# EAGLE schematic hx1 (EAGLE 7.2.0)
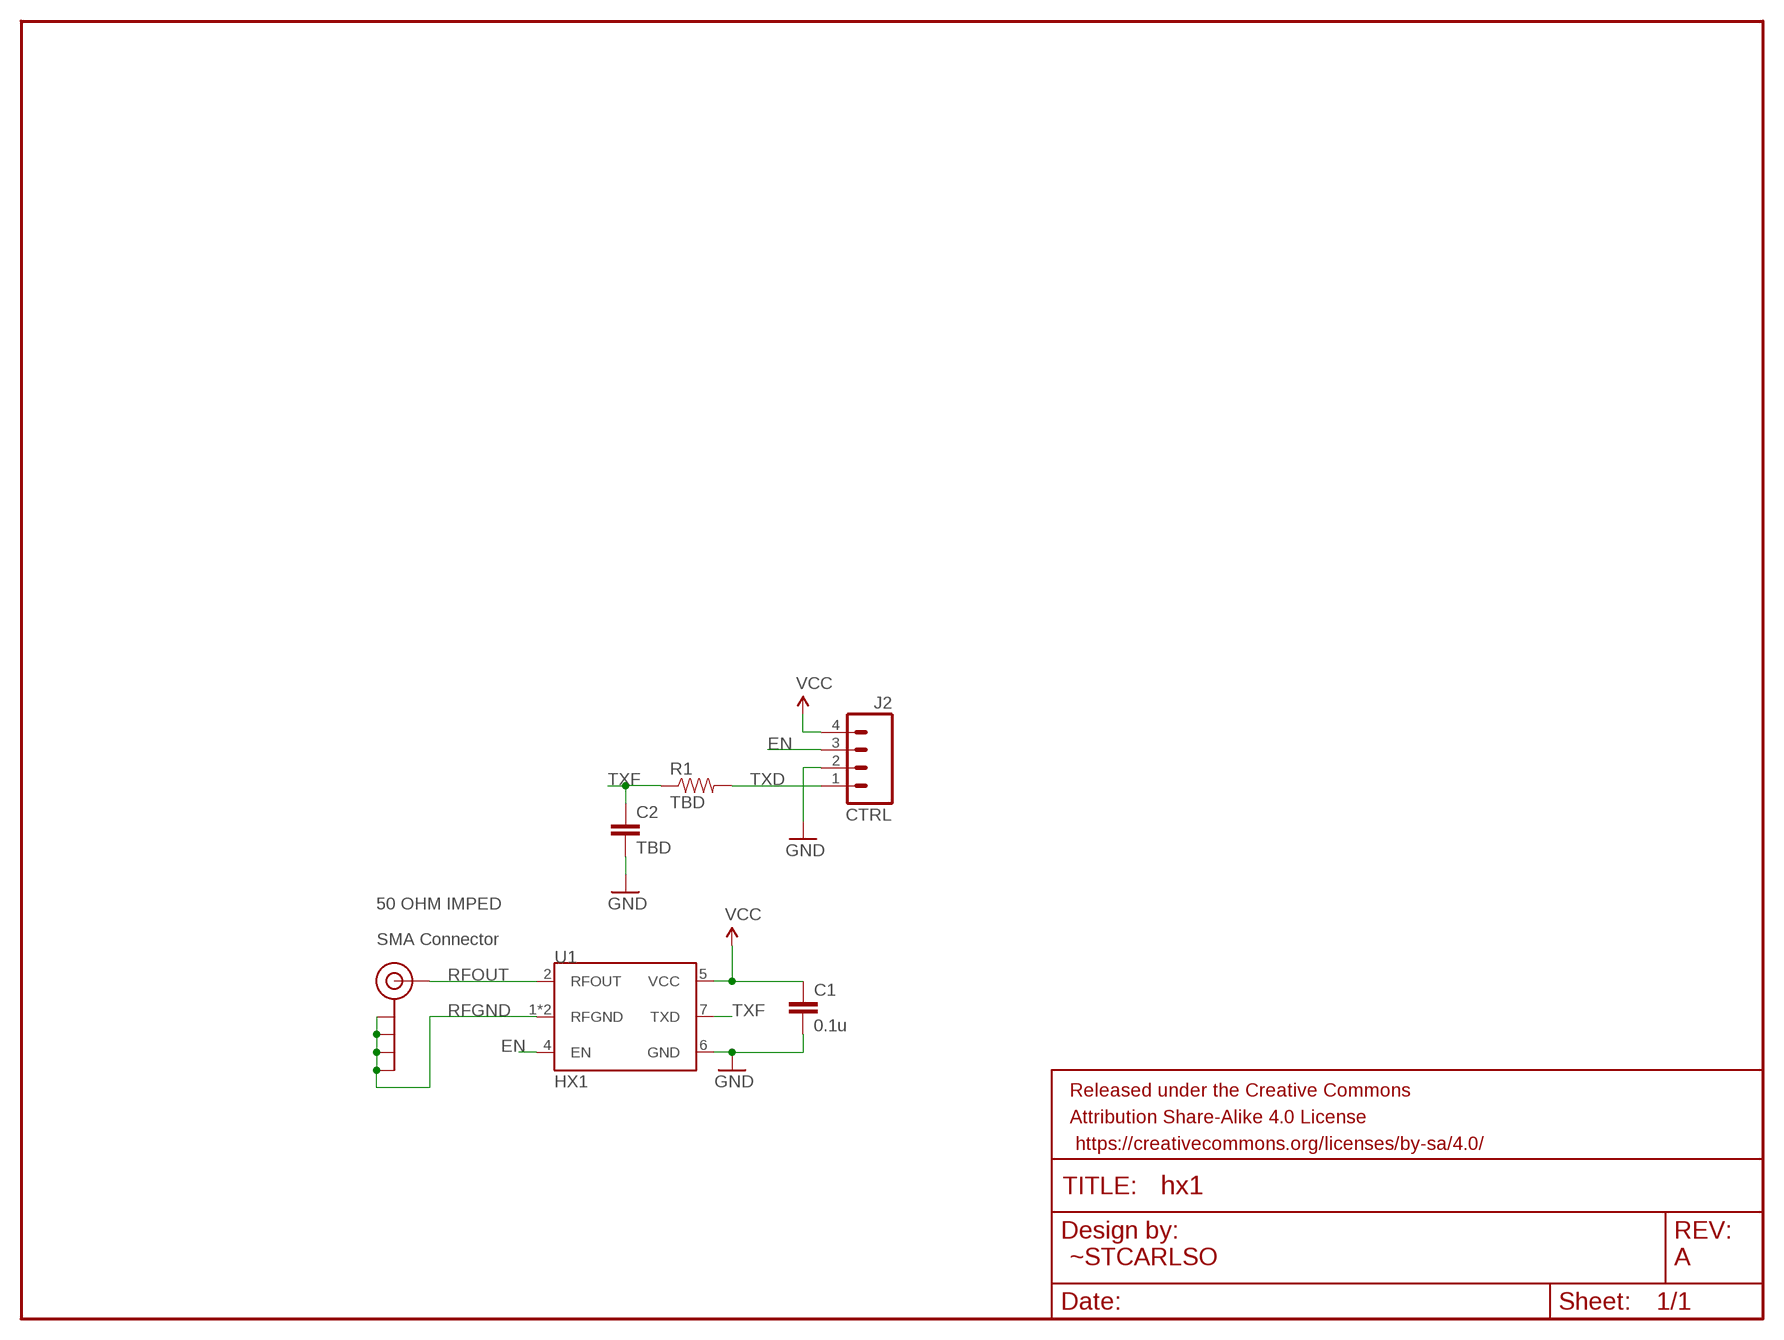
[diagram p0: schematic, sheet 1]

## Parts
C1  0.1u  CAPPTH  [CAP-PTH-SMALL]
C2  TBD  CAPPTH  [CAP-PTH-SMALL]
FRAME1  FRAME-LETTERNO_PACKAGE  [DUMMY]
J1  SMA_EDGE  [SMA-EDGE]
J2  CTRL  M04PTH  [1X04]
R1  TBD  RESISTORAXIAL-0.3  [AXIAL-0.3]
U1  HX1  [1X12]

## Nets
EN: J2.3 U1.4(EN)
GND: C1.2 C2.2 J2.2 U1.6(GND)
RFGND: J1.GND@0(GND) J1.GND@1(GND) J1.GND@2(GND) J1.GND@3(GND) U1.1(RFGND) U1.3(RFGND)
RFOUT: J1.SIG(SIGNAL) U1.2(RFOUT)
TXD: J2.1 R1.P$2
TXF: C2.1 R1.P$1 U1.7(TXD)
VCC: C1.1 J2.4 U1.5(VCC)

## Notes on the sheet
- 50 OHM IMPED
- SMA Connector
- ~STCARLSO | A

## Library data of the parts
C1 C2 = SparkFun-Passives:CAP: Capacitor Standard 0603 ceramic capacitor, and 0.1" leaded capacitor.
FRAME1 = SparkFun-Aesthetics:FRAME-LETTER: Schematic Frame Standard 8.5x11 US Letter frame; DESIGNER: Nobody; VERSION: v01
J1 = SparkFun-Connectors:SMA_EDGE: SMA Antenna Connector End launch SMA connector. The paste layer has been removed so that the connector can be hand soldered onto the board after reflow.
J2 = SparkFun-Connectors:M04: Header 4 Standard 4-pin 0.1" header. Use with straight break away headers (SKU : PRT-00116), right angle break away headers (PRT-00553), swiss pins (PRT-00743), machine pins (PRT-00117), and female headers (PRT-00115). Molex polarized connector foot print use with SKU : PRT-08231 with associated crimp pins and housings. 1MM SMD Version SKU: PRT-10208
R1 = SparkFun-Passives:RESISTOR: Resistor Basic schematic elements and footprints for 0603, 1206, and PTH resistors.
U1 = HAB:HX1: Radiometrix HX1 High-power VHF Narrow Band 300 mW Transmitter